# Altium schematic sheet FTDI_USB_UART.SchDoc
size A
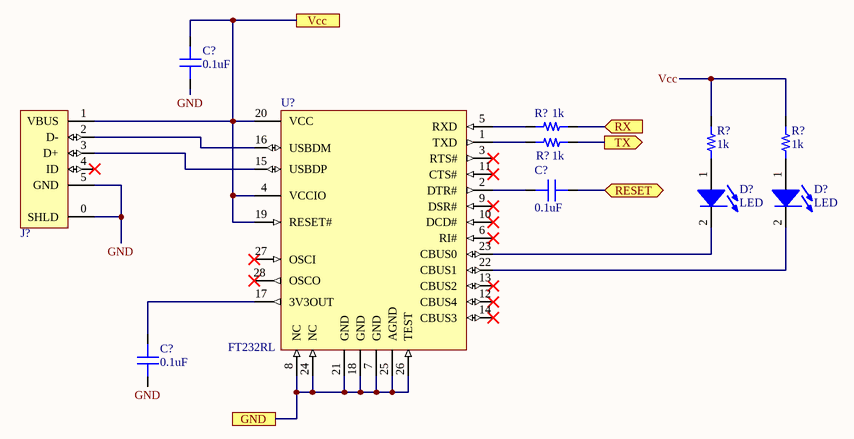
[diagram p0: FTDI_USB_UART.SchDoc]

## Parts
(Parts that share a designator on the sheet are numbered #1, #2 ... from top to bottom, then left to right.)
C?#1  capacitance: 0.1uF  [0603]  (hidden comment: capacitor)
C?#2  capacitance: 0.1uF  [0603]  (hidden comment: capacitor)
C?#3  capacitance: 0.1uF  [0603]  (hidden comment: capacitor)
D?#1  LED  [0805_LED]
D?#2  LED  [0805_LED]
J?  USB Micro  [ZX62WRD-B-5PC]  (value not drawn)
R?#1  resistance: 1k  [0603]  (hidden comment: resistor)
R?#2  resistance: 1k  [0603]  (hidden comment: resistor)
R?#3  resistance: 1k  [0603]  (hidden comment: resistor)
R?#4  resistance: 1k  [0603]  (hidden comment: resistor)
U?  FT232RL  [SSOP-28]

## Ports
GND, RESET (bidir), RX (in), TX (out), Vcc

## Nets
GND: U?.7(GND) U?.8(NC) U?.18(GND) U?.21(GND) U?.24(NC) U?.25(AGND) U?.26(TEST) ; port GND
GND: C?#1.1 C?#3.1 J?.0(SHLD) J?.5(GND)  [a separate net that carries the same name]
RESET: C?#2.1 ; port RESET
RX: R?#1.2 ; port RX
TX: R?#2.1 ; port TX
Vcc: C?#1.2 J?.1(VBUS) U?.4(VCCIO) U?.19(RESET#) U?.20(VCC) ; port Vcc
Vcc: R?#3.2 R?#4.2  [a separate net that carries the same name]
NetC?#2_2: C?#2.2 U?.2(DTR#)
NetC?#3_2: C?#3.2 U?.17(3V3OUT)
NetD?#1_1: D?#1.1(A) R?#3.1
NetD?#1_2: D?#1.2(K) U?.23(CBUS0)
NetD?#2_1: D?#2.1(A) R?#4.1
NetD?#2_2: D?#2.2(K) U?.22(CBUS1)
NetJ?_2: J?.2(D-) U?.16(USBDM)
NetJ?_3: J?.3(D+) U?.15(USBDP)
NetR?#1_1: R?#1.1 U?.5(RXD)
NetR?#2_2: R?#2.2 U?.1(TXD)

Not connected (* = marked no-connect by the designer): J? 4(ID)*; U? 3(RTS#)* 6(RI#)* 9(DSR#)* 10(DCD#)* 11(CTS#)* 12(CBUS4)* 13(CBUS2)* 14(CBUS3)* 27(OSCI)* 28(OSCO)*

## Library data of the parts
C?#1-C?#3 = 1: Generic 0603 capacitor; id: 1
D?#1 D?#2 = 19: Generic 0805 LED; id: 19
J? = 29: Micro USB; id: 29
R?#1-R?#4 = 1: id: 1
U? = 3: id: 3